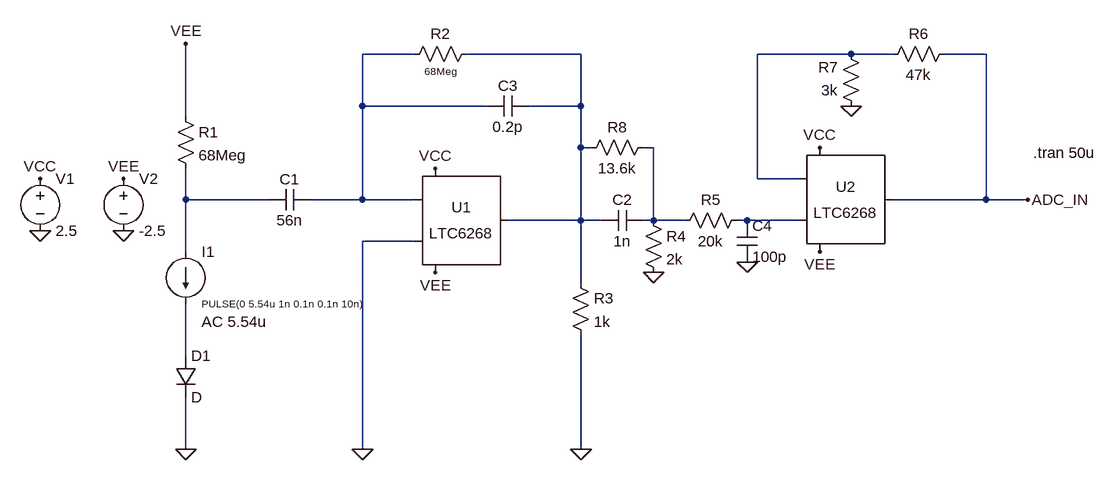
[diagram p0: schematic Dosimeter_Circuit.asc]
Dosimeter_Circuit.asc, the LTspice schematic file:
Version 4.1
SHEET 1 932 680
WIRE -128 -240 -208 -240
WIRE 128 -240 -48 -240
WIRE 544 -240 400 -240
WIRE 608 -240 544 -240
WIRE 752 -240 688 -240
WIRE -208 -160 -208 -240
WIRE -16 -160 -208 -160
WIRE 128 -160 128 -240
WIRE 128 -160 48 -160
WIRE -480 -144 -480 -256
WIRE 128 -96 128 -160
WIRE 144 -96 128 -96
WIRE 240 -96 224 -96
WIRE 400 -48 400 -240
WIRE 464 -48 400 -48
WIRE -480 -16 -480 -64
WIRE -352 -16 -480 -16
WIRE -208 -16 -208 -160
WIRE -208 -16 -288 -16
WIRE -128 -16 -208 -16
WIRE 752 -16 752 -240
WIRE 752 -16 608 -16
WIRE 816 -16 752 -16
WIRE 128 16 128 -96
WIRE 128 16 16 16
WIRE 160 16 128 16
WIRE 240 16 240 -96
WIRE 240 16 224 16
WIRE 288 16 240 16
WIRE 384 16 368 16
WIRE 464 16 384 16
WIRE -128 48 -208 48
WIRE -480 64 -480 -16
WIRE 128 112 128 16
WIRE -480 224 -480 144
WIRE -480 368 -480 288
WIRE -208 368 -208 48
WIRE 128 368 128 192
FLAG -480 368 0
FLAG -208 368 0
FLAG 128 368 0
FLAG -704 32 0
FLAG -704 -48 VCC
FLAG -96 -64 VCC
FLAG -96 96 VEE
FLAG 496 -96 VCC
FLAG 496 64 VEE
FLAG 816 -16 ADC_IN
FLAG -480 -256 VEE
FLAG 240 96 0
FLAG 384 80 0
FLAG -576 32 0
FLAG -576 -48 VEE
FLAG 544 -160 0
SYMBOL res -496 -160 R0
SYMATTR InstName R1
SYMATTR Value 68Meg
SYMATTR SpiceLine tol=1 pwr=0.1
SYMBOL res -32 -256 R90
WINDOW 0 0 56 VBottom 2
WINDOW 3 32 56 VTop 1
SYMATTR InstName R2
SYMATTR Value 68Meg
SYMBOL cap -288 -32 R90
WINDOW 0 0 32 VBottom 2
WINDOW 3 32 32 VTop 2
SYMATTR InstName C1
SYMATTR Value 56n
SYMATTR SpiceLine V=16 Irms=0 Rser=11 Lser=0
SYMBOL diode -496 224 R0
SYMATTR InstName D1
SYMBOL current -480 64 R0
WINDOW 3 24 80 Left 1
WINDOW 123 24 108 Left 2
WINDOW 39 0 0 Left 0
SYMATTR Value PULSE(0 5.54u 1n 0.1n 0.1n 10n)
SYMATTR Value2 AC 5.54u
SYMATTR InstName I1
SYMBOL OpAmps\\LTC6268 -96 16 R0
SYMATTR InstName U1
SYMBOL voltage -704 -64 R0
WINDOW 123 0 0 Left 0
WINDOW 39 0 0 Left 0
SYMATTR InstName V1
SYMATTR Value 2.5
SYMBOL res 112 96 R0
SYMATTR InstName R3
SYMATTR Value 1k
SYMBOL cap 224 0 R90
WINDOW 0 0 32 VBottom 2
WINDOW 3 32 32 VTop 2
SYMATTR InstName C2
SYMATTR Value 1n
SYMBOL voltage -576 -64 R0
WINDOW 123 0 0 Left 0
WINDOW 39 0 0 Left 0
SYMATTR InstName V2
SYMATTR Value -2.5
SYMBOL OpAmps\\LTC6268 496 -16 R0
SYMATTR InstName U2
SYMBOL cap 48 -176 R90
WINDOW 0 0 32 VBottom 2
WINDOW 3 32 32 VTop 2
SYMATTR InstName C3
SYMATTR Value 0.2p
SYMBOL res 224 0 R0
SYMATTR InstName R4
SYMATTR Value 2k
SYMBOL cap 368 16 R0
SYMATTR InstName C4
SYMATTR Value 100p
SYMBOL res 384 0 R90
WINDOW 0 0 56 VBottom 2
WINDOW 3 32 56 VTop 2
SYMATTR InstName R5
SYMATTR Value 20k
SYMBOL res 704 -256 R90
WINDOW 0 0 56 VBottom 2
WINDOW 3 32 56 VTop 2
SYMATTR InstName R6
SYMATTR Value 47k
SYMBOL res 560 -144 R180
WINDOW 0 36 76 Left 2
WINDOW 3 36 40 Left 2
SYMATTR InstName R7
SYMATTR Value 3k
SYMBOL res 240 -112 R90
WINDOW 0 0 56 VBottom 2
WINDOW 3 32 56 VTop 2
SYMATTR InstName R8
SYMATTR Value 13.6k
TEXT 824 -88 Left 2 !.tran 50u

The netlist it stands for:
* Dosimeter_Circuit.asc
R1 VEE N005 68Meg tol=1 pwr=0.1
R2 N002 N001 68Meg
C1 N001 N005 56n V=16 Irms=0 Rser=11 Lser=0
D1 N007 0 D
I1 N005 N007 PULSE(0 5.54u 1n 0.1n 0.1n 10n) AC 5.54u
X§U1 0 N001 N002 VCC VEE NC_01 LTC6268
V1 VCC 0 2.5
R3 N002 0 1k
C2 N004 N002 1n
V2 VEE 0 -2.5
X§U2 N006 N003 ADC_IN VCC VEE NC_02 LTC6268
C3 N002 N001 0.2p
R4 N004 0 2k
C4 N006 0 100p
R5 N006 N004 20k
R6 ADC_IN N003 47k
R7 0 N003 3k
R8 N004 N002 13.6k
.model D D
.lib standard.dio
.tran 50u
.lib LTC2.lib
.backanno
.end